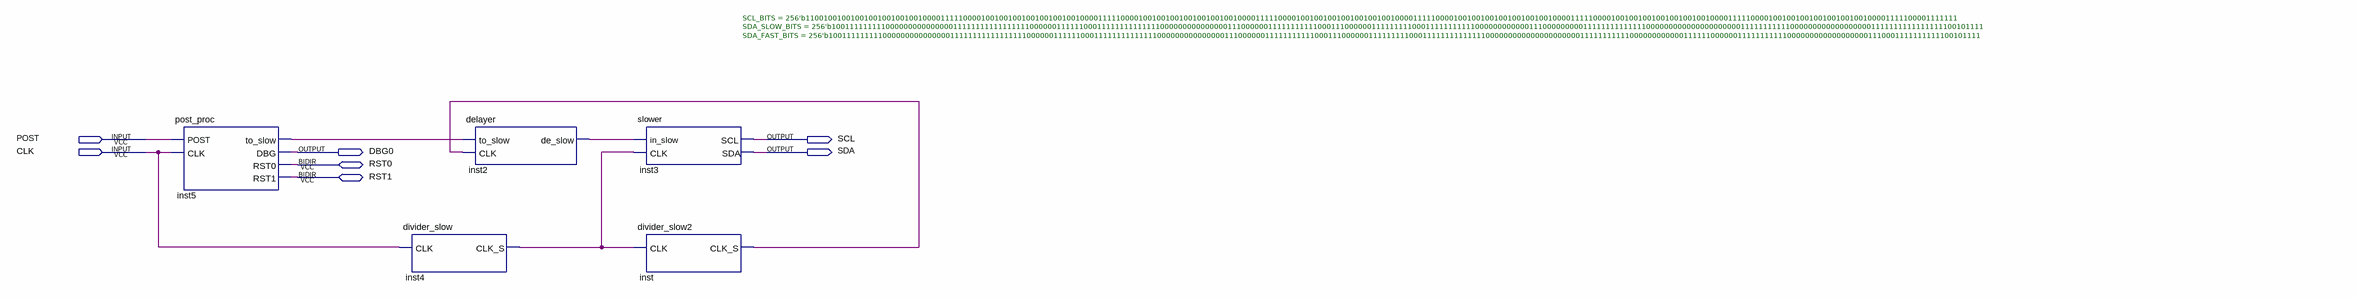
[diagram p0: schematic sheet]
// Quartus schematic FreeRunner_SRGH.bdf as structural Verilog: 5 symbols, 7 pins
module FreeRunner_SRGH (
  input  POST,
  input  CLK,
  inout  RST0,
  inout  RST1,
  output SCL,
  output DBG0,
  output SDA
);

  wire inst2_de_slow, inst4_clk_s, inst5_to_slow, inst_clk_s;

  post_proc inst5 (.POST(POST), .CLK(CLK), .to_slow(inst5_to_slow), .DBG(DBG0), .RST0(RST0), .RST1(RST1));
  divider_slow inst4 (.CLK(CLK), .CLK_S(inst4_clk_s));
  delayer inst2 (.to_slow(inst5_to_slow), .CLK(inst_clk_s), .de_slow(inst2_de_slow));
  slower #(.SCL_BITS(256'b1100100100100100100100100100001111100001001001001001001001001000011111000010010010010010010010010000111110000100100100100100100100100001111100001001001001001001001001000011111000010010010010010010010010000111110000100100100100100100100100001111100001111111), .SDA_SLOW_BITS(256'b1001111111110000000000000001111111111111111100000011111100011111111111111000000000000000111000000111111111110001110000001111111110001111111111100000000000011100000000011111111111111000000000000000000000111111111110000000000000000001111111111111111100101111), .SDA_FAST_BITS(256'b1001111111110000000000000001111111111111111100000011111100011111111111111000000000000000111000000111111111110001110000001111111110001111111111111100000000000000000000011111111111000000000000111111000000111111111110000000000000000001110001111111111100101111)) inst3 (
    .in_slow(inst2_de_slow), .CLK(inst4_clk_s), .SCL(SCL), .SDA(SDA));
  divider_slow2 inst (.CLK(inst4_clk_s), .CLK_S(inst_clk_s));
endmodule
